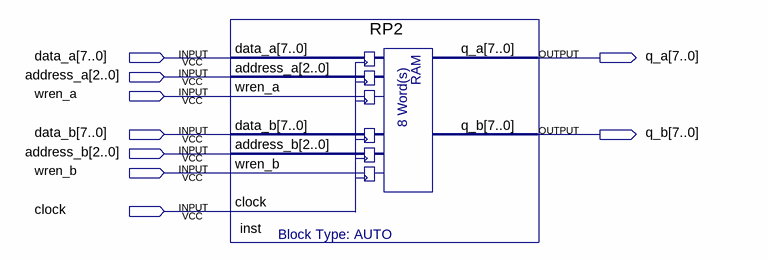
[diagram p0: schematic sheet]
// Quartus schematic RP_from_megawizard.bdf as structural Verilog: 1 symbols, 9 pins
module RP_from_megawizard (
  input  [7:0] data_a,
  input  [2:0] address_a,
  input  wren_a,
  input  [7:0] data_b,
  input  [2:0] address_b,
  input  wren_b,
  input  clock,
  output [7:0] q_a,
  output [7:0] q_b
);

  RP2 inst (
    .data_a(data_a), .address_a(address_a), .wren_a(wren_a), .data_b(data_b), .address_b(address_b),
    .wren_b(wren_b), .clock(clock), .q_a(q_a), .q_b(q_b));
endmodule
